# Altium project MB1605.PrjPcb (part 7 of 7)
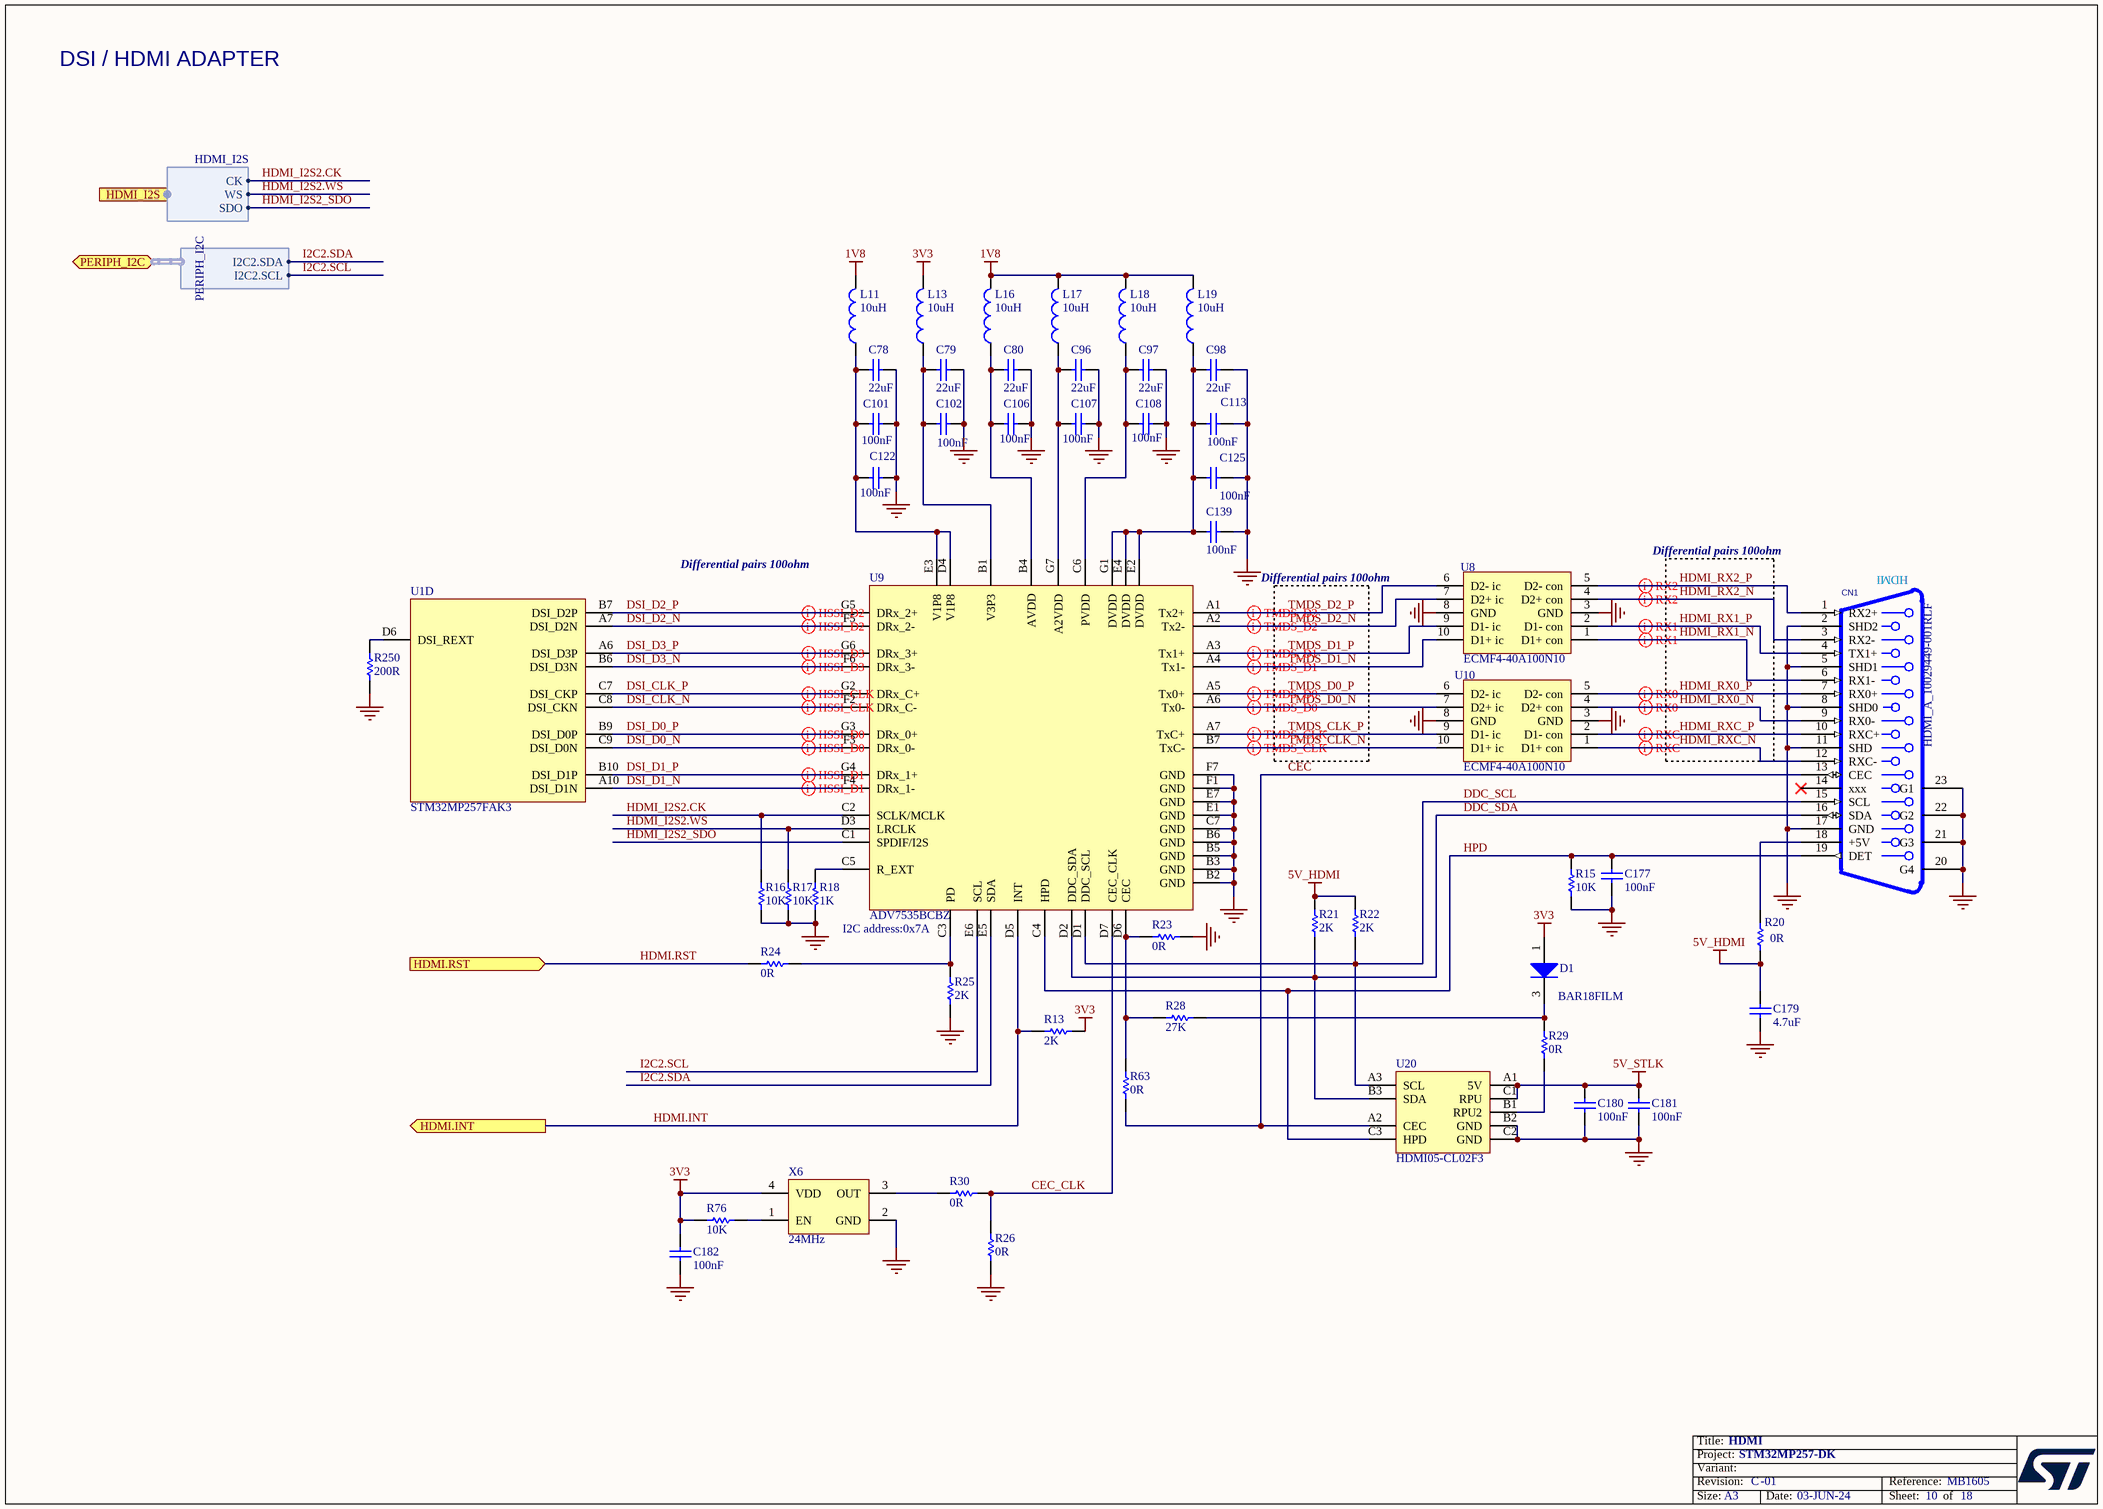
[diagram p18: HDMI.SchDoc]

## Nets that join several sheets
1V8: Power_PMIC (5 pins), Power_MPU (21 pins), SDcard_eMMC (11 pins), HDMI (5 pins)
3V3: WLAN_BLUETOOTH (10 pins), Peripherals (R136.1 R138.2 R142.2 R144.1), MP257_14x14 (R224.2 R228.2), Power_PMIC (8 pins), LVDS (C84.2 CN2.3 CN2.4 R3.1), USB_HUB (10 pins), USB3 (6 pins), CAMERA (C224.2 CN8.22), AUDIO (5 pins), Expansion_Connector (C232.1 CN5.1 CN5.17), ETHERNET (L15.2 L21.2), HDMI (6 pins)
5V_HDMI: Power_PMIC (C91.1 U26.7), HDMI (C179.2 R20.1 R21.2 R22.2)
5V_STLK: Power_PMIC (25 pins), LVDS (R4.2), STLINK_V3EC (7 pins), USB_HUB (C143.2 C146.2 L12.1), USB3 (C94.2 Q5.5 Q5.6), Expansion_Connector (C233.2 CN5.2 CN5.4), HDMI (C180.2 C181.2 U20.A1 U20.C1)
5V_VCONN: Power_PMIC (C214.1 U26.5), USB3 (5 pins)
GND: WLAN_BLUETOOTH (22 pins), Peripherals (17 pins), MP257_14x14 (9 pins), Power_PMIC (63 pins), Power_MPU (118 pins), LVDS (27 pins), STLINK_V3EC (105 pins), USB_HUB (36 pins), USB3 (44 pins), CAMERA (23 pins), AUDIO (5 pins), Expansion_Connector (10 pins), LPDDR4 (79 pins), SDcard_eMMC (30 pins), ETHERNET (42 pins), HDMI (53 pins)
VBAT: Peripherals (R139.2), Power_MPU (C87.2 D6.3 U1.T6)
VDD1_DDR: Power_PMIC (C40.2 U26.44), LPDDR4 (15 pins)
VDD2_DDR: Power_PMIC (5 pins), Power_MPU (14 pins), LPDDR4 (59 pins)
VDD3V3_USB: Power_PMIC (C61.2 U26.13), Power_MPU (R286.1)
VDD_EMMC: Power_PMIC (C190.1 U26.16), SDcard_eMMC (6 pins)
VDD_SDCARD: Power_PMIC (C215.1 U26.4), SDcard_eMMC (C218.2 CN6.4)
VDDA1V8_AON: MP257_14x14 (U1.W2), Power_PMIC (C189.2 U26.14), Power_MPU (C234.2 U1.AB3)
VDDCORE: Power_PMIC (6 pins), Power_MPU (24 pins)
VDDCPU: Power_PMIC (5 pins), Power_MPU (16 pins)
VDDGPU: Power_PMIC (6 pins), Power_MPU (18 pins)
VDDIO: Peripherals (9 pins), MP257_14x14 (9 pins), Power_PMIC (6 pins), Power_MPU (17 pins), STLINK_V3EC (LNK13.1), USB3 (R223.2)
VDDIO_SDCARD: Power_PMIC (C217.1 U26.2), Power_MPU (C195.2 U1.D14 U1.E13), SDcard_eMMC (7 pins)
BOOT0: Peripherals (SW1.1 TP15.1), MP257_14x14 (U1.Y3)
BOOT1: Peripherals (SW1.2 TP16.1), MP257_14x14 (U1.AA3)
BOOT2: Peripherals (SW2.1 TP25.1), MP257_14x14 (U1.AB1)
BOOT3: Peripherals (SW2.2 TP32.1), MP257_14x14 (U1.AB2)
BT_DEV_WAKE: WLAN_BLUETOOTH (U40.39), MP257_14x14 (U1.AE6)
BT_HOST_WAKE: WLAN_BLUETOOTH (U40.38), MP257_14x14 (U1.AG5)
BT_PCM_CLK: WLAN_BLUETOOTH (U40.11), MP257_14x14 (U1.T3)
BT_PCM_SDI: WLAN_BLUETOOTH (U40.10), MP257_14x14 (U1.P4)
BT_PCM_SDO: WLAN_BLUETOOTH (U40.9), MP257_14x14 (U1.K4)
BT_PCM_WS: WLAN_BLUETOOTH (U40.8), MP257_14x14 (U1.U2)
BT_REG_ON: WLAN_BLUETOOTH (TP19.1 U40.14), MP257_14x14 (U1.AD6)
BUTTON.TAMP: Peripherals (5 pins), MP257_14x14 (U1.W5)
BUTTON.USER1: Peripherals (C162.2 R127.1), MP257_14x14 (U1.AD10)
BUTTON.USER2: Peripherals (C161.2 R126.1), MP257_14x14 (U1.AD8)
CAM.EN: MP257_14x14 (U1.A11), CAMERA (CN8.18 U33.1)
CAM.IMU_INT1: MP257_14x14 (U1.F10), CAMERA (CN8.14 U31.1)
CAM.IMU_INT2: MP257_14x14 (U1.B11), CAMERA (CN8.15 U14.1)
CAM.RST: MP257_14x14 (U1.C12), CAMERA (CN8.17 U32.1)
CAM.TOF_INT: MP257_14x14 (U1.D8), CAMERA (CN8.12 U29.1)
CAM.TOF_LPn: MP257_14x14 (U1.C11), CAMERA (CN8.11 U11.1)
CTP.INT: MP257_14x14 (U1.J3), LVDS (CN2.2 U4.1)
CTP.RST: MP257_14x14 (U1.L7), LVDS (CN2.6 R3.2 U7.1)
DISP.BLCTRL: MP257_14x14 (U1.J5), LVDS (CN2.37 U23.1)
DISP.LED_EN: MP257_14x14 (U1.P6), LVDS (CN2.36 U22.1)
eMMC.SDMMC2_CK: MP257_14x14 (U1.B25), SDcard_eMMC (R103.1 U37.M6)
eMMC.SDMMC2_CMD: MP257_14x14 (U1.D24), SDcard_eMMC (R104.1 U37.M5)
eMMC.SDMMC2_D0: MP257_14x14 (U1.C24), SDcard_eMMC (R101.1 U37.A3)
eMMC.SDMMC2_D1: MP257_14x14 (U1.B23), SDcard_eMMC (U37.A4)
eMMC.SDMMC2_D2: MP257_14x14 (U1.C23), SDcard_eMMC (U37.A5)
eMMC.SDMMC2_D3: MP257_14x14 (U1.C25), SDcard_eMMC (U37.B2)
eMMC.SDMMC2_D4: MP257_14x14 (U1.D22), SDcard_eMMC (U37.B3)
eMMC.SDMMC2_D5: MP257_14x14 (U1.A23), SDcard_eMMC (U37.B4)
eMMC.SDMMC2_D6: MP257_14x14 (U1.A22), SDcard_eMMC (U37.B5)
eMMC.SDMMC2_D7: MP257_14x14 (U1.B22), SDcard_eMMC (U37.B6)
ETH1.CLK: MP257_14x14 (U1.AF11), ETHERNET (R196.1)
ETH1.CLK125: MP257_14x14 (U1.AA13), ETHERNET (R176.1)
ETH1.GTX_CLK: MP257_14x14 (U1.AB14), ETHERNET (R161.1)
ETH1.MDC: MP257_14x14 (U1.AF15), ETHERNET (R195.1 U38.13)
ETH1.MDINT: MP257_14x14 (U1.AC13), ETHERNET (R318.1 U38.31)
ETH1.MDIO: MP257_14x14 (U1.AE15), ETHERNET (R191.1 U38.14)
ETH1.NRST: MP257_14x14 (R205.1 U1.AF17), ETHERNET (U38.12)
ETH1.RX_CLK: MP257_14x14 (U1.AB12), ETHERNET (R109.1 R149.1 R305.2)
ETH1.RX_CTL: MP257_14x14 (U1.AD12), ETHERNET (R110.1 R150.1 R304.2)
ETH1.RXD0: MP257_14x14 (U1.AE11), ETHERNET (R111.1 R120.1 R293.2)
ETH1.RXD1: MP257_14x14 (U1.AE12), ETHERNET (R112.1 R121.1 R292.2)
ETH1.RXD2: MP257_14x14 (U1.AF13), ETHERNET (R113.2 R147.1)
ETH1.RXD3: MP257_14x14 (U1.AG13), ETHERNET (R114.1 R148.1 R303.2)
ETH1.TX_CTL: MP257_14x14 (U1.AD14), ETHERNET (R164.1)
ETH1.TXD0: MP257_14x14 (U1.AE13), ETHERNET (R167.1)
ETH1.TXD1: MP257_14x14 (U1.AG14), ETHERNET (R173.1)
ETH1.TXD2: MP257_14x14 (U1.AF14), ETHERNET (R178.1)
ETH1.TXD3: MP257_14x14 (U1.AE14), ETHERNET (R185.1)
EXP_GPIO2: MP257_14x14 (R246.1 U1.Y6), Expansion_Connector (CN5.3)
EXP_GPIO3: MP257_14x14 (R245.1 U1.V3), Expansion_Connector (CN5.5)
EXP_GPIO4: MP257_14x14 (TP11.1 U1.AE4), Expansion_Connector (CN5.7)
EXP_GPIO5: MP257_14x14 (U1.AG10), Expansion_Connector (CN5.29)
EXP_GPIO6: MP257_14x14 (U1.AD16), Expansion_Connector (CN5.31)
EXP_GPIO7: MP257_14x14 (U1.R5), Expansion_Connector (CN5.26)
EXP_GPIO8: MP257_14x14 (U1.AF10), Expansion_Connector (CN5.24)
EXP_GPIO9: MP257_14x14 (U1.AC9), Expansion_Connector (CN5.21)
EXP_GPIO10: MP257_14x14 (U1.AF9), Expansion_Connector (CN5.19)
EXP_GPIO11: MP257_14x14 (U1.AB8), Expansion_Connector (CN5.23)
EXP_GPIO12: MP257_14x14 (U1.AE17), Expansion_Connector (CN5.32)
EXP_GPIO13: MP257_14x14 (U1.AC19), Expansion_Connector (CN5.33)
EXP_GPIO14: MP257_14x14 (U1.P2), Expansion_Connector (CN5.8)
EXP_GPIO15: MP257_14x14 (U1.P3), Expansion_Connector (CN5.10)
EXP_GPIO16: MP257_14x14 (U1.R2), Expansion_Connector (CN5.36)
EXP_GPIO17: MP257_14x14 (U1.R3), Expansion_Connector (CN5.11)
EXP_GPIO18: MP257_14x14 (U1.D12), Expansion_Connector (CN5.12)
EXP_GPIO19: MP257_14x14 (U1.B17), Expansion_Connector (CN5.35)
EXP_GPIO20: MP257_14x14 (U1.A19), Expansion_Connector (CN5.38)
EXP_GPIO21: MP257_14x14 (U1.C14), Expansion_Connector (CN5.40)
EXP_GPIO22: MP257_14x14 (U1.T4), Expansion_Connector (CN5.15)
EXP_GPIO23: MP257_14x14 (U1.U7), Expansion_Connector (CN5.16)
EXP_GPIO24: MP257_14x14 (U1.V4), Expansion_Connector (CN5.18)
EXP_GPIO25: MP257_14x14 (U1.V2), Expansion_Connector (CN5.22)
EXP_GPIO26: MP257_14x14 (U1.V1), Expansion_Connector (CN5.37)
EXP_GPIO27: MP257_14x14 (U1.U3), Expansion_Connector (CN5.13)
HDMI.INT: MP257_14x14 (U1.B15), HDMI (R13.2 U9.D5)
HDMI.RST: MP257_14x14 (U1.C13), HDMI (R24.1)
HDMI_I2S2.CK: MP257_14x14 (U1.B13), HDMI (R16.2 U9.C2)
HDMI_I2S2.WS: MP257_14x14 (U1.B14), HDMI (R17.2 U9.D3)
HDMI_I2S2_SDO: MP257_14x14 (U1.A14), HDMI (U9.C1)
I2C1.SCL: MP257_14x14 (R224.1 U1.P1), USB3 (U50.18)
I2C1.SDA: MP257_14x14 (R228.1 U1.M6), USB3 (U50.17)
I2C2.SCL: MP257_14x14 (R32.1 U1.AC15), LVDS (CN2.7 U13.1), USB_HUB (SB1.1), CAMERA (CN8.20 U19.1), Expansion_Connector (CN5.28), HDMI (U9.E6)
I2C2.SDA: MP257_14x14 (R31.1 U1.AA15), LVDS (CN2.8 U3.1), USB_HUB (SB2.1), CAMERA (CN8.21 U39.1), Expansion_Connector (CN5.27), HDMI (U9.E5)
I2C7.SCL: MP257_14x14 (R261.1 U1.E15), Power_PMIC (U26.33)
I2C7.SDA: MP257_14x14 (R260.1 U1.E19), Power_PMIC (U26.34)
JTCK_SWCLK: MP257_14x14 (TP43.1 U1.AA5), STLINK_V3EC (R153.2)
JTDI: MP257_14x14 (TP41.1 U1.AE3), STLINK_V3EC (R207.2)
JTDO_SWDO: MP257_14x14 (TP13.1 U1.AC2), STLINK_V3EC (R129.2)
JTMS_SWDIO: MP257_14x14 (TP40.1 U1.AE2), STLINK_V3EC (R209.2)
LED1: Peripherals (LD7.2), MP257_14x14 (U1.AB16)
LED2: Peripherals (Q3.1 R137.2), MP257_14x14 (U1.AG18)
LED3: Peripherals (Q2.1 R141.2), MP257_14x14 (U1.AF19)
LED4: Peripherals (Q1.1 R143.2), MP257_14x14 (U1.AE16)
LPO_32: WLAN_BLUETOOTH (TP17.1 U40.37), MP257_14x14 (U1.U5)
MDF.CCK: MP257_14x14 (U1.AE18), AUDIO (U12.3 U53.3)
MDF.SDI6: MP257_14x14 (U1.AF18), AUDIO (U12.4 U53.4)
MP257_WAKEUP: MP257_14x14 (U1.AF5), Power_PMIC (U26.32)
NRST: Peripherals (B1.1 R33.1 TP22.1 U15.1), MP257_14x14 (C33.2 U1.AE1), Power_PMIC (R81.1), STLINK_V3EC (R212.2)
NRSTC1MS: MP257_14x14 (R27.1 R272.1 U1.W3), Power_PMIC (R59.1), SDcard_eMMC (D7.2)
PMIC_WAKEUPn: MP257_14x14 (U1.W7), Power_PMIC (R46.1)
PWR_CPU_ON: MP257_14x14 (R272.2 U1.AB4), Power_PMIC (R60.1)
PWR_ON: MP257_14x14 (U1.AD3), Power_PMIC (R61.1)
SD.SDMMC1_CK: MP257_14x14 (U1.C21), SDcard_eMMC (R9.1)
SD.SDMMC1_CMD: MP257_14x14 (U1.C20), SDcard_eMMC (CN6.3 R37.1 U5.4 U5.7)
SD.SDMMC1_D0: MP257_14x14 (U1.B21), SDcard_eMMC (CN6.7 R38.1 U6.2 U6.9)
SD.SDMMC1_D1: MP257_14x14 (U1.C22), SDcard_eMMC (CN6.8 R39.1 U6.4 U6.7)
SD.SDMMC1_D2: MP257_14x14 (U1.B19), SDcard_eMMC (CN6.1 R35.1 U5.1 U5.10)
SD.SDMMC1_D3: MP257_14x14 (U1.C19), SDcard_eMMC (CN6.2 R36.1 U5.2 U5.9)
SD.uSD_DETECT: MP257_14x14 (U1.G13), SDcard_eMMC (R40.1)
TCPP_EN: MP257_14x14 (U1.AD18), USB3 (R10.1)
TCPP_INTN: MP257_14x14 (U1.AD4), USB3 (U50.19)
USART1_CTS: WLAN_BLUETOOTH (U40.5), MP257_14x14 (U1.N7)
USART1_RTS: WLAN_BLUETOOTH (U40.4), MP257_14x14 (U1.N5)
USART1_RX: WLAN_BLUETOOTH (TP9.1 U40.3), MP257_14x14 (U1.K6)
USART1_TX: WLAN_BLUETOOTH (TP1.1 U40.2), MP257_14x14 (U1.N1)
USBH_N: USB_HUB (U34.19), USB3 (U1.AG21)
USBH_P: USB_HUB (U34.20), USB3 (U1.AF21)
USBSW_OE: MP257_14x14 (U1.AC17), USB3 (R105.1 U56.7)
USBSW_S: MP257_14x14 (U1.AE19), USB3 (R106.2 U56.6)
VBUS_DIV: MP257_14x14 (TP35.1 U1.AE5), USB3 (C99.1 R219.1 R220.2)
VCONN_CC1_EN: MP257_14x14 (U1.AA11), USB3 (Q11.1 R41.2)
VCONN_CC2_EN: MP257_14x14 (U1.AA9), USB3 (Q12.1 R200.2)
WL.SDMMC3_CK: WLAN_BLUETOOTH (TP10.1 U40.20), MP257_14x14 (U1.A26)
WL.SDMMC3_CMD: WLAN_BLUETOOTH (R93.2 U40.22), MP257_14x14 (U1.B26)
WL.SDMMC3_D0: WLAN_BLUETOOTH (R92.2 U40.24), MP257_14x14 (U1.C27)
WL.SDMMC3_D1: WLAN_BLUETOOTH (R91.2 U40.26), MP257_14x14 (U1.D25)
WL.SDMMC3_D2: WLAN_BLUETOOTH (R90.2 U40.23), MP257_14x14 (U1.C26)
WL.SDMMC3_D3: WLAN_BLUETOOTH (R89.2 U40.25), MP257_14x14 (U1.B27)
WL_HOST_WAKE: WLAN_BLUETOOTH (U40.27), MP257_14x14 (U1.N2)
WL_REG_ON: WLAN_BLUETOOTH (TP18.1 U40.28), MP257_14x14 (U1.L5)

## Assembly variants
MP257F: not fitted C25 C165 C166 C167 C174 C175 C176 CN14 D7 R16 R17 R23 R25 R26 R27 R29 R94 R95 R109 R110 R111 R112 R139 R196 R223 R227 R229 R303 R325 SB1 SB2 U49